# Altium schematic sheet USB_hub.SchDoc: USB Hub
size A4; DocumentNumber: 2; SheetNumber: 2; SheetTotal: 4; RelSerie: X
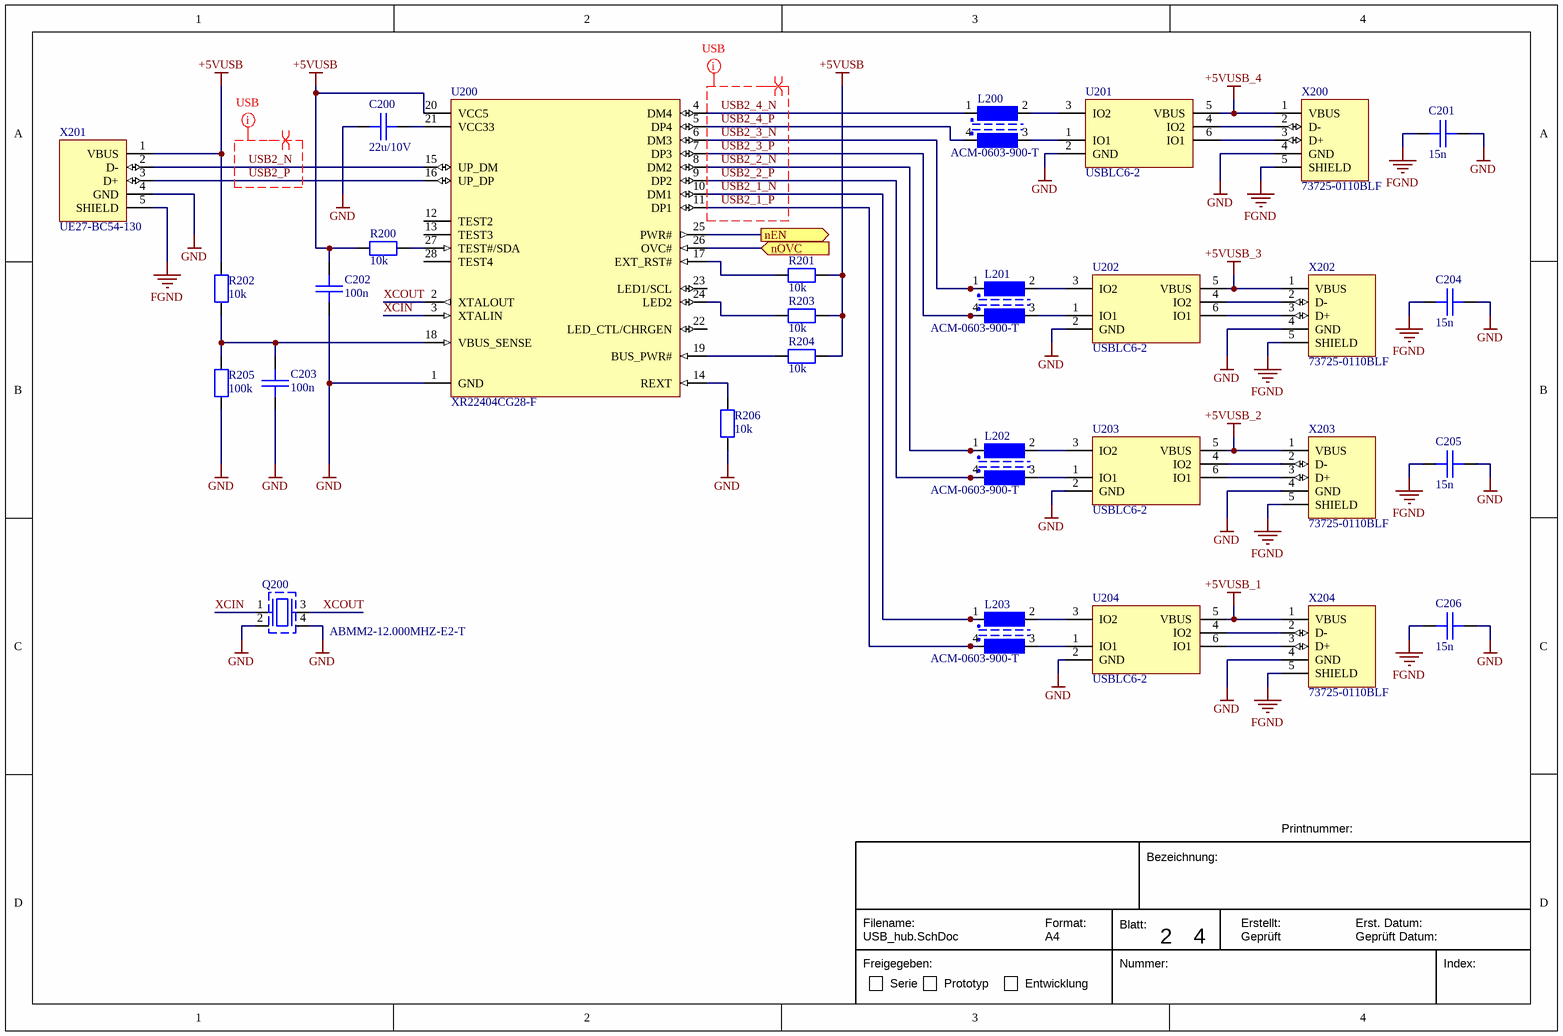
[diagram p0: USB_hub.SchDoc]

## Parts
C200  22u/10V  [0805_C_E0]
C201  15n  [0603_C]
C202  100n  [0603_C]
C203  100n  [0603_C]
C204  15n  [0603_C]
C205  15n  [0603_C]
C206  15n  [0603_C]
L200  ACM-0603-900-T  [ACM-0603-900-T]
L201  ACM-0603-900-T  [ACM-0603-900-T]
L202  ACM-0603-900-T  [ACM-0603-900-T]
L203  ACM-0603-900-T  [ACM-0603-900-T]
Q200  ABMM2-12.000MHZ-E2-T  [ABMM2]
R200  10k  [0805_R]
R201  10k  [0805_R]
R202  10k  [0805_R]
R203  10k  [0805_R]
R204  10k  [0805_R]
R205  100k  [0805_R]
R206  10k  [0805_R]
U200  XR22404CG28-F  [SSOP-28]
U201  USBLC6-2  [SOT-666]
U202  USBLC6-2  [SOT-666]
U203  USBLC6-2  [SOT-666]
U204  USBLC6-2  [SOT-666]
X200  73725-0110BLF  [73725-0110BLF]
X201  UE27-BC54-130  [UE27BC54130]
X202  73725-0110BLF  [73725-0110BLF]
X203  73725-0110BLF  [73725-0110BLF]
X204  73725-0110BLF  [73725-0110BLF]

## Ports
nEN (out), nOVC (in)

## Nets
+5VUSB: C202.2 R200.2 R201.2 R202.2 R203.2 R204.1 U200.20(VCC5) X201.1(VBUS)
+5VUSB_1: U204.5(VBUS) X204.1(VBUS)
+5VUSB_2: U203.5(VBUS) X203.1(VBUS)
+5VUSB_3: U202.5(VBUS) X202.1(VBUS)
+5VUSB_4: U201.5(VBUS) X200.1(VBUS)
FGND: C201.1 C204.1 C205.1 C206.1 X200.5(SHIELD) X201.5(SHIELD) X202.5(SHIELD) X203.5(SHIELD) X204.5(SHIELD)
GND: C200.2 C201.2 C202.1 C203.1 C204.2 C205.2 C206.2 Q200.2 Q200.4 R205.1 R206.2 U200.1(GND) U201.2(GND) U202.2(GND) U203.2(GND) U204.2(GND) X200.4(GND) X201.4(GND) X202.4(GND) X203.4(GND) X204.4(GND)
nEN: U200.25(PWR#) ; port nEN
nOVC: U200.26(OVC#) ; port nOVC
USB2_1_N: L203.1 U200.10(DM1)
USB2_1_P: L203.4 U200.11(DP1)
USB2_2_N: L202.1 U200.8(DM2)
USB2_2_P: L202.4 U200.9(DP2)
USB2_3_N: L201.1 U200.6(DM3)
USB2_3_P: L201.4 U200.7(DP3)
USB2_4_N: L200.1 U200.4(DM4)
USB2_4_P: L200.4 U200.5(DP4)
USB2_N: U200.15(UP_DM) X201.2(D-)
USB2_P: U200.16(UP_DP) X201.3(D+)
XCIN: Q200.1 U200.3(XTALIN)
XCOUT: Q200.3 U200.2(XTALOUT)
NetC200_1: C200.1 U200.21(VCC33)
NetC203_2: C203.2 R202.1 R205.2 U200.18(VBUS_SENSE)
NetL200_2: L200.2 U201.3(IO2)
NetL200_3: L200.3 U201.1(IO1)
NetL201_2: L201.2 U202.3(IO2)
NetL201_3: L201.3 U202.1(IO1)
NetL202_2: L202.2 U203.3(IO2)
NetL202_3: L202.3 U203.1(IO1)
NetL203_2: L203.2 U204.3(IO2)
NetL203_3: L203.3 U204.1(IO1)
NetR200_1: R200.1 U200.27(TEST#/SDA)
NetR201_1: R201.1 U200.17(EXT_RST#)
NetR203_1: R203.1 U200.24(LED2)
NetR204_2: R204.2 U200.19(BUS_PWR#)
NetR206_1: R206.1 U200.14(REXT)
NetU201_4: U201.4(IO2) X200.2(D-)
NetU201_6: U201.6(IO1) X200.3(D+)
NetU202_4: U202.4(IO2) X202.2(D-)
NetU202_6: U202.6(IO1) X202.3(D+)
NetU203_4: U203.4(IO2) X203.2(D-)
NetU203_6: U203.6(IO1) X203.3(D+)
NetU204_4: U204.4(IO2) X204.2(D-)
NetU204_6: U204.6(IO1) X204.3(D+)

Not connected (* = marked no-connect by the designer): U200 12(TEST2) 13(TEST3) 22(LED_CTL/CHRGEN) 23(LED1/SCL) 28(TEST4)

## Layout directives
differential pair: USB2_1_N, USB2_1_P, USB2_2_N, USB2_2_P, USB2_3_N, USB2_3_P, USB2_4_N, USB2_4_P, USB2_N, USB2_P
net class USB: USB2_1_N, USB2_1_P, USB2_2_N, USB2_2_P, USB2_3_N, USB2_3_P, USB2_4_N, USB2_4_P, USB2_N, USB2_P

## Notes on the sheet
- Bezeichnung:
- Printnummer:
- Filename:
- Format:
- Blatt:
- Erstellt:
- Erst. Datum:
- Freigegeben:
- Serie
- Prototyp
- Entwicklung
- A4
- Nummer:
- Geprüft
- Geprüft Datum:
- Index:

## Library data of the parts
C200-C206 = C: Chip capacitor, generic
L200-L203 = L_ACM-0603-900-T: INDUCTOR COMMON MODE SMD; Manufacturer: Abracon; Max Output Current: 200mA; Number of Inputs: 1; Supplier 1: Digi-Key; Supplier Part Number 1: 535-12407-1-ND; Manufacturer Part Number: ACM-0603-900-T; Case/Package: 0603; ComponentLink1URL: https://datasheet.ciiva.com/29370/acm-0603-29370512.pdf; ComponentLink1Description: https://datasheet.ciiva.com/29370/acm-0603-29370512.pdf; ComponentLink2Description: http://www.mouser.com/ds/2/115/AP21410_21510-740863.pdf; ComponentLink2URL: http://www.mouser.com/ds/2/115/AP21410_21510-740863.pdf; ComponentLink3Description: http://www.diodes.com/_files/datasheets/AP21410_21510.pdf; ComponentLink3URL: http://www.diodes.com/_files/datasheets/AP21410_21510.pdf; Contact Plating: Tin,Matte; Max Operating Temperature: 85°C; Min Operating Temperature: -40°C; Mount: Surface Mount; Number of Outputs: 1; Pricing 2: 1=0.41, 10=0.351, 100=0.2624, 500=0.2062, 1000=0.15934 (USD); Stock 2: 2006; Supplier 2: Digi-Key; Supplier Part Number 2: AP21410FM-7DICT-ND
Q200 = Q_ABMM2-12.000MHZ-E2-T: 12MHz ±20ppm Crystal 18pF 50 Ohm -20°C ~ 70°C  Surface Mount 4-SMD, No Lead (DFN, LCC); Manufacturer: Abracon; Supplier 1: Digi-Key; Supplier Part Number 1: 535-9631-1-ND; Manufacturer Part Number: ABMM2-12.000MHZ-E2-T; Case/Package: CSMD; ComponentLink1URL: https://datasheet.ciiva.com/15116/getdatasheetpartid-719825-15116727.pdf; ComponentLink1Description: https://datasheet.ciiva.com/15116/getdatasheetpartid-719825-15116727.pdf; ComponentLink2URL: https://datasheet.ciiva.com/855/abmm2-855417.pdf; ComponentLink2Description: https://datasheet.ciiva.com/855/abmm2-855417.pdf; ComponentLink3URL: https://datasheet.ciiva.com/3176/abmm2-3176137.pdf; ComponentLink3Description: https://datasheet.ciiva.com/3176/abmm2-3176137.pdf; ComponentLink4URL: https://datasheet.ciiva.com/855/abmm2-855418.pdf; ComponentLink4Description: https://datasheet.ciiva.com/855/abmm2-855418.pdf; ComponentLink5URL: https://datasheet.ciiva.com/855/abmm2-855419.pdf; ComponentLink5Description: https://datasheet.ciiva.com/855/abmm2-855419.pdf; ComponentLink6URL: https://datasheet.ciiva.com/16214/abmm2-16214428.pdf; ComponentLink6Description: https://datasheet.ciiva.com/16214/abmm2-16214428.pdf
R200-R206 = R: Resistor, generic
U200 = U_T_XR22404CG28-F: USB Controller USB 2.0 USB Interface; Manufacturer: Exar; Supplier 1: Digi-Key; Supplier Part Number 1: 1016-2163-ND; Manufacturer Part Number: XR22404CG28-F; ComponentLink1Description: Datasheet; ComponentLink1URL: https://www.exar.com/ds/xr22404.pdf
U201-U204 = D_USBLC6-2: TVS DIODE 5.25VWM 17VC SOT666; Manufacturer: STMicroelectronics; Manufacturer Part Number: USBLC6-2P6; Supplier 1: Digi-Key; Supplier Part Number 1: 497-5026-1-ND; ComponentLink1URL: https://datasheet.ciiva.com/15143/getdatasheetpartid-98673-15143462.pdf; ComponentLink1Description: https://datasheet.ciiva.com/15143/getdatasheetpartid-98673-15143462.pdf; ComponentLink2URL: https://datasheet.ciiva.com/14186/usblc6-2-st-eng-tds-14186568.pdf; ComponentLink2Description: https://datasheet.ciiva.com/14186/usblc6-2-st-eng-tds-14186568.pdf; ComponentLink3URL: https://datasheet.ciiva.com/22692/1690354-22692453.pdf; ComponentLink3Description: https://datasheet.ciiva.com/22692/1690354-22692453.pdf; ComponentLink4URL: https://datasheet.ciiva.com/22685/1690354-22685832.pdf; ComponentLink4Description: https://datasheet.ciiva.com/22685/1690354-22685832.pdf; ComponentLink5URL: https://datasheet.ciiva.com/16378/cd00050750-16378714.pdf; ComponentLink5Description: https://datasheet.ciiva.com/16378/cd00050750-16378714.pdf; ComponentLink6URL: https://datasheet.ciiva.com/4508/cd00050750-4508892.pdf; ComponentLink6Description: https://datasheet.ciiva.com/4508/cd00050750-4508892.pdf; ComponentLink7URL: https://datasheet.ciiva.com/41444/001184108-da-01-en-ic-esd-protection-usblc6-2p6-sot-666-stm-41444134.pdf; ComponentLink7Description: https://datasheet.ciiva.com/41444/001184108-da-01-en-ic-esd-protection-usblc6-2p6-sot-666-stm-41444134.pdf; Case/Package: SOT-666
X200 X202-X204 = X_73725-0110BLF: CONN RCPT USB2.0 TYPEA 4POS R/A
X201 = X_UE27-BC54-130: USB Connectors 4P PCB R/A TYPE B BLACK W/ REAR SHIELD; Manufacturer 1: Amphenol Commercial; Manufacturer Part Number 1: UE27-BC54-130; ComponentLink1URL: https://datasheet.ciiva.com/10945/ue27bcx4xxx-10945210.pdf; ComponentLink1Description: https://datasheet.ciiva.com/10945/ue27bcx4xxx-10945210.pdf; ComponentLink2URL: https://datasheet.ciiva.com/851/ue27bcx4xxx-851809.pdf; ComponentLink2Description: https://datasheet.ciiva.com/851/ue27bcx4xxx-851809.pdf; ComponentLink3URL: https://datasheet.ciiva.com/16668/ue27bcx4xxx-16668218.pdf; ComponentLink3Description: https://datasheet.ciiva.com/16668/ue27bcx4xxx-16668218.pdf; Supplier 1: Digi-Key; Supplier Part Number 1: UE27BC54130-ND